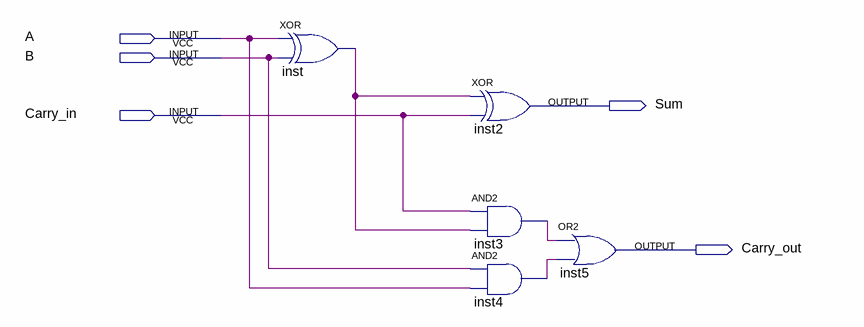
[diagram p0: schematic sheet]
// Quartus schematic Full_adder.bdf as structural Verilog: 5 symbols, 5 pins
module Full_adder (
  input  A,
  input  B,
  input  Carry_in,
  output Sum,
  output Carry_out
);

  wire inst3_out, inst4_out, inst_out;

  xor inst (inst_out, A, B);
  xor inst2 (Sum, inst_out, Carry_in);
  and inst3 (inst3_out, Carry_in, inst_out);
  and inst4 (inst4_out, B, A);
  or inst5 (Carry_out, inst3_out, inst4_out);
endmodule
